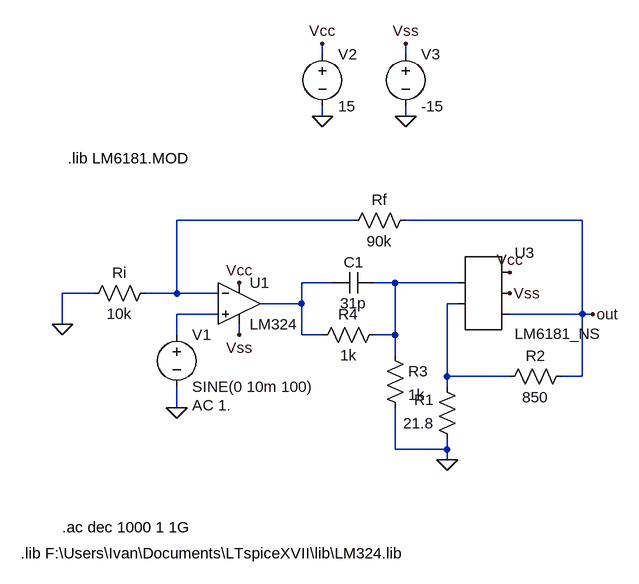
[diagram p0: schematic TP3.asc]
TP3.asc, the LTspice schematic file:
Version 4
SHEET 1 880 680
WIRE 96 -208 96 -224
WIRE 224 -208 224 -224
WIRE 96 -112 96 -128
WIRE 224 -112 224 -128
WIRE 144 48 -128 48
WIRE 496 48 224 48
WIRE 112 144 64 144
WIRE 208 144 176 144
WIRE 304 144 208 144
WIRE -256 160 -304 160
WIRE -128 160 -128 48
WIRE -128 160 -176 160
WIRE -64 160 -128 160
WIRE 64 176 64 144
WIRE 64 176 0 176
WIRE 304 176 288 176
WIRE -64 192 -128 192
WIRE 496 192 496 48
WIRE 496 192 384 192
WIRE 512 192 496 192
WIRE -304 208 -304 160
WIRE -128 224 -128 192
WIRE -32 224 -32 208
WIRE 64 224 64 176
WIRE 96 224 64 224
WIRE 208 224 208 144
WIRE 208 224 176 224
WIRE 208 256 208 224
WIRE 288 288 288 176
WIRE 384 288 288 288
WIRE 496 288 496 192
WIRE 496 288 464 288
WIRE 288 304 288 288
WIRE -128 336 -128 304
WIRE 208 400 208 336
WIRE 288 400 288 384
WIRE 288 400 208 400
WIRE 288 416 288 400
FLAG 288 416 0
FLAG -304 208 0
FLAG -128 336 0
FLAG 96 -112 0
FLAG 224 -112 0
FLAG 96 -224 Vcc
FLAG 224 -224 Vss
FLAG 384 128 Vcc
FLAG 384 160 Vss
FLAG 512 192 out
FLAG -32 144 Vcc
FLAG -32 224 Vss
SYMBOL res -160 144 R90
WINDOW 0 0 56 VBottom 2
WINDOW 3 32 56 VTop 2
SYMATTR InstName Ri
SYMATTR Value 10k
SYMBOL res 240 32 R90
WINDOW 0 0 56 VBottom 2
WINDOW 3 32 56 VTop 2
SYMATTR InstName Rf
SYMATTR Value 90k
SYMBOL res 304 400 R180
WINDOW 0 36 76 Left 2
WINDOW 3 36 40 Left 2
SYMATTR InstName R1
SYMATTR Value 21.8
SYMBOL res 368 304 R270
WINDOW 0 32 56 VTop 2
WINDOW 3 0 56 VBottom 2
SYMATTR InstName R2
SYMATTR Value 850
SYMBOL voltage 96 -224 R0
WINDOW 123 0 0 Left 0
WINDOW 39 0 0 Left 0
SYMATTR InstName V2
SYMATTR Value 15
SYMBOL voltage 224 -224 R0
WINDOW 123 0 0 Left 0
WINDOW 39 0 0 Left 0
SYMATTR InstName V3
SYMATTR Value -15
SYMBOL voltage -128 208 R0
WINDOW 123 24 124 Left 2
WINDOW 39 0 0 Left 0
SYMATTR Value2 AC 1.
SYMATTR InstName V1
SYMATTR Value SINE(0 10m 100)
SYMBOL AutoGenerated\\LM6181_NS 336 160 R0
SYMATTR InstName U3
SYMBOL res 192 240 R0
SYMATTR InstName R3
SYMATTR Value 1k
SYMBOL cap 176 128 R90
WINDOW 0 0 32 VBottom 2
WINDOW 3 32 32 VTop 2
SYMATTR InstName C1
SYMATTR Value 31p
SYMBOL res 192 208 R90
WINDOW 0 0 56 VBottom 2
WINDOW 3 32 56 VTop 2
SYMATTR InstName R4
SYMATTR Value 1k
SYMBOL OpAmps\\LM324 -32 176 R0
SYMATTR InstName U1
TEXT -368 560 Left 2 !.lib F:\\Users\\Ivan\\Documents\\LTspiceXVII\\lib\\LM324.lib
TEXT -304 520 Left 2 !.ac dec 1000 1 1G
TEXT -296 -48 Left 2 !.lib LM6181.MOD

The netlist it stands for:
* TP3.asc
Ri N001 0 10k
Rf out N001 90k
R1 0 N004 21.8
R2 N004 out 850
V2 Vcc 0 15
V3 Vss 0 -15
V1 N005 0 SINE(0 10m 100) AC 1.
* U3: LM6181_NS (symbol AutoGenerated\LM6181_NS not available, pins judged from their places): pin1=N003 pin2=N004 pin3=Vcc pin4=Vss pin5=out
R3 N003 0 1k
C1 N003 N002 31p
R4 N003 N002 1k
* U1: LM324 (symbol OpAmps\LM324 not available, pins judged from their places): In+=N005 In-=N001 V+=Vcc V-=Vss OUT=N002
.lib F:\Users\Ivan\Documents\LTspiceXVII\lib\LM324.lib
.ac dec 1000 1 1G
.lib LM6181.MOD
.backanno
.end